# EAGLE design Macropad_BMS (EAGLE 9.6.2)
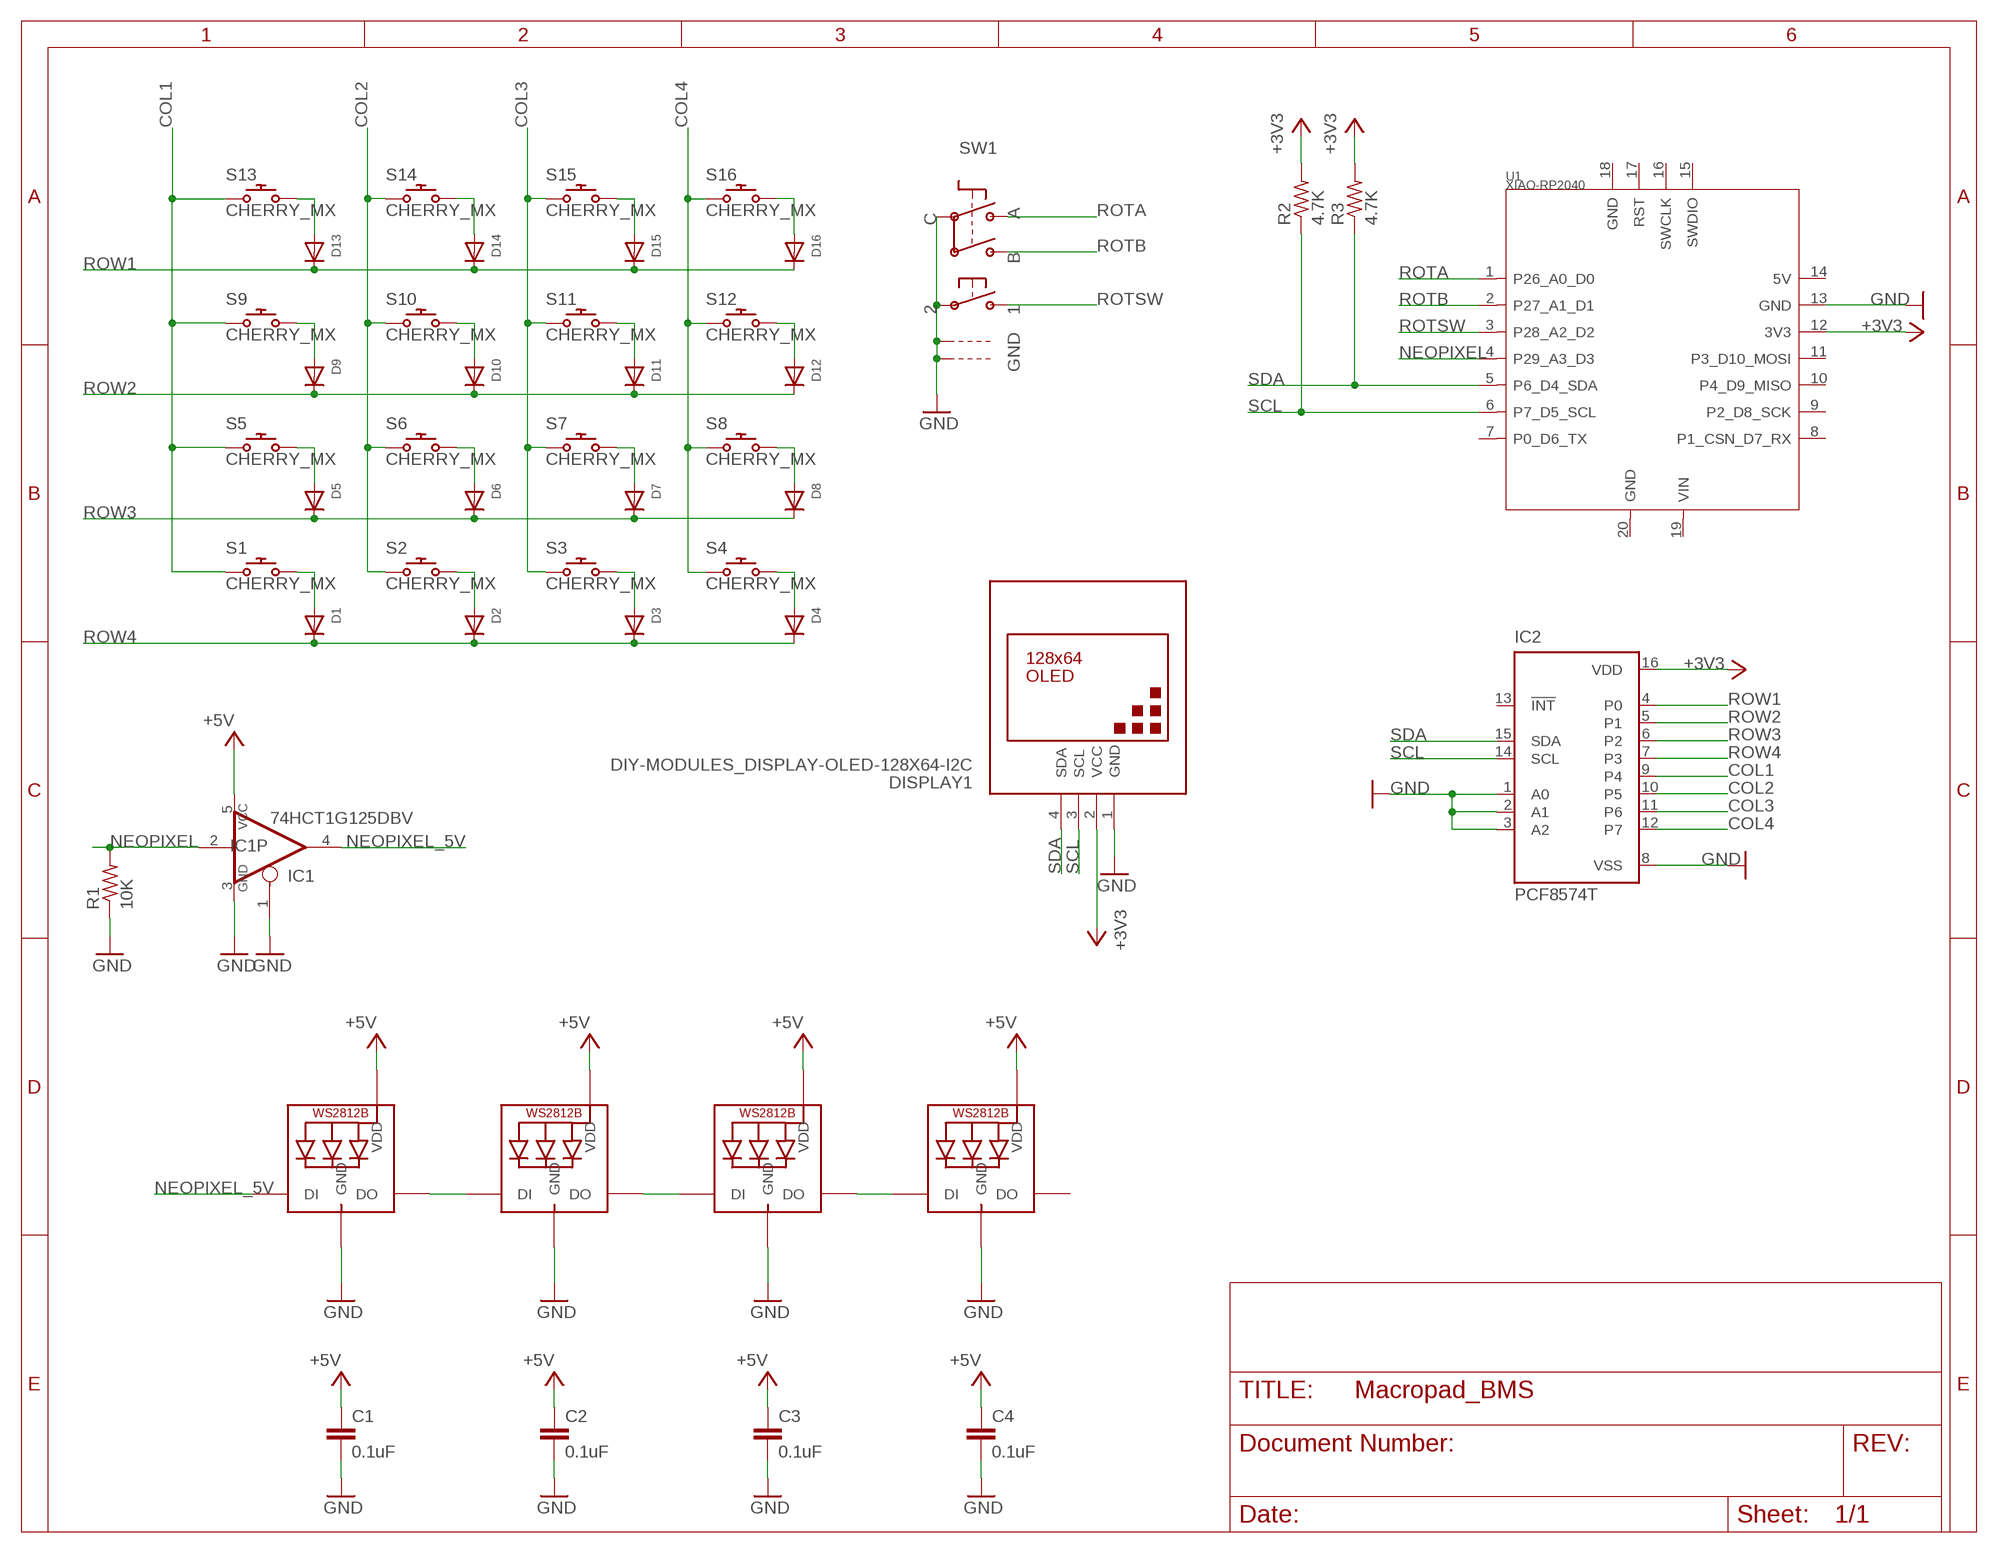
[diagram p0: schematic, sheet 1]

## Parts
C1  0.1uF  0.1UF-0603-25V-(+80/-20%)  [0603]
C2  0.1uF  0.1UF-0603-25V-(+80/-20%)  [0603]
C3  0.1uF  0.1UF-0603-25V-(+80/-20%)  [0603]
C4  0.1uF  0.1UF-0603-25V-(+80/-20%)  [0603]
D1  MICROBUILDER_DIODESOD-123  [MICROBUILDER_SOD-123]
D2  MICROBUILDER_DIODESOD-123  [MICROBUILDER_SOD-123]
D3  MICROBUILDER_DIODESOD-123  [MICROBUILDER_SOD-123]
D4  MICROBUILDER_DIODESOD-123  [MICROBUILDER_SOD-123]
D5  MICROBUILDER_DIODESOD-123  [MICROBUILDER_SOD-123]
D6  MICROBUILDER_DIODESOD-123  [MICROBUILDER_SOD-123]
D7  MICROBUILDER_DIODESOD-123  [MICROBUILDER_SOD-123]
D8  MICROBUILDER_DIODESOD-123  [MICROBUILDER_SOD-123]
D9  MICROBUILDER_DIODESOD-123  [MICROBUILDER_SOD-123]
D10  MICROBUILDER_DIODESOD-123  [MICROBUILDER_SOD-123]
D11  MICROBUILDER_DIODESOD-123  [MICROBUILDER_SOD-123]
D12  MICROBUILDER_DIODESOD-123  [MICROBUILDER_SOD-123]
D13  MICROBUILDER_DIODESOD-123  [MICROBUILDER_SOD-123]
D14  MICROBUILDER_DIODESOD-123  [MICROBUILDER_SOD-123]
D15  MICROBUILDER_DIODESOD-123  [MICROBUILDER_SOD-123]
D16  MICROBUILDER_DIODESOD-123  [MICROBUILDER_SOD-123]
DISPLAY1  DIY-MODULES_DISPLAY-OLED-128X64-I2C  [DIY-MODULES_DISPLAY-OLED-128X64-I2C]
IC1  74HCT1G125DBV  74AHC1G125DBV  [SOT23-5]
IC2  PCF8574T  [SO16W]
LED1  WS2812B5050  [WS2812B]
LED2  WS2812B5050  [WS2812B]
LED3  WS2812B5050  [WS2812B]
LED4  WS2812B5050  [WS2812B]
R1  10K  R-US_R0805  [R0805]
R2  4.7K  R-US_R0805  [R0805]
R3  4.7K  R-US_R0805  [R0805]
S1  CHERRY_MX  [CHERRY_MX]
S2  CHERRY_MX  [CHERRY_MX]
S3  CHERRY_MX  [CHERRY_MX]
S4  CHERRY_MX  [CHERRY_MX]
S5  CHERRY_MX  [CHERRY_MX]
S6  CHERRY_MX  [CHERRY_MX]
S7  CHERRY_MX  [CHERRY_MX]
S8  CHERRY_MX  [CHERRY_MX]
S9  CHERRY_MX  [CHERRY_MX]
S10  CHERRY_MX  [CHERRY_MX]
S11  CHERRY_MX  [CHERRY_MX]
S12  CHERRY_MX  [CHERRY_MX]
S13  CHERRY_MX  [CHERRY_MX]
S14  CHERRY_MX  [CHERRY_MX]
S15  CHERRY_MX  [CHERRY_MX]
S16  CHERRY_MX  [CHERRY_MX]
SW1  ADAFRUIT_ELECTROMECH_ENCODER_PLUS_SWITCH_BOURNS_PEC11  [ADAFRUIT_ELECTROMECH_PEC11+SWITCH]
U1  XIAO-RP2040  [XIAO-SAMD21/RP2040-MODULE14P-2.54-21X17.8MM]

## Nets
+3V3: DISPLAY1.2(VCC) IC2.16(VDD) R2.2 R3.2 U1.12(3V3)
+5V: C1.1 C2.1 C3.1 C4.1 IC1.5(VCC) LED1.1-VDD(VDD) LED2.1-VDD(VDD) LED3.1-VDD(VDD) LED4.1-VDD(VDD)
COL1: IC2.9(P4) S1.S1 S5.S1 S9.S1 S13.S1
COL2: IC2.10(P5) S2.S1 S6.S1 S10.S1 S14.S1
COL3: IC2.11(P6) S3.S1 S7.S1 S11.S1 S15.S1
COL4: IC2.12(P7) S4.S1 S8.S1 S12.S1 S16.S1
GND: C1.2 C2.2 C3.2 C4.2 DISPLAY1.1(GND) IC1.1(OE) IC1.3(GND) IC2.1(A0) IC2.2(A1) IC2.3(A2) IC2.8(VSS) LED1.3-GND(GND) LED2.3-GND(GND) LED3.3-GND(GND) LED4.3-GND(GND) R1.1 SW1.P$2 SW1.P$C SW1.P$GND1 SW1.P$GND2 U1.13(GND)
N$2: D13.A S13.S2
N$3: D14.A S14.S2
N$4: LED1.2-DOUT(DO) LED2.4-DIN(DI)
N$5: LED2.2-DOUT(DO) LED3.4-DIN(DI)
N$6: LED3.2-DOUT(DO) LED4.4-DIN(DI)
N$7: D15.A S15.S2
N$8: D16.A S16.S2
N$9: D9.A S9.S2
N$10: D10.A S10.S2
N$11: D11.A S11.S2
N$12: D12.A S12.S2
N$13: D5.A S5.S2
N$14: D6.A S6.S2
N$15: D7.A S7.S2
N$16: D8.A S8.S2
N$18: D1.A S1.S2
N$19: D2.A S2.S2
N$20: D3.A S3.S2
N$21: D4.A S4.S2
NEOPIXEL: IC1.2(I) R1.2 U1.4(P29_A3_D3)
NEOPIXEL_5V: IC1.4(O) LED1.4-DIN(DI)
ROTA: SW1.P$A U1.1(P26_A0_D0)
ROTB: SW1.P$B U1.2(P27_A1_D1)
ROTSW: SW1.P$1 U1.3(P28_A2_D2)
ROW1: D13.C D14.C D15.C D16.C IC2.4(P0)
ROW2: D9.C D10.C D11.C D12.C IC2.5(P1)
ROW3: D5.C D6.C D7.C D8.C IC2.6(P2)
ROW4: D1.C D2.C D3.C D4.C IC2.7(P3)
SCL: DISPLAY1.3(SCL) IC2.14(SCL) R2.1 U1.6(P7_D5_SCL)
SDA: DISPLAY1.4(SDA) IC2.15(SDA) R3.1 U1.5(P6_D4_SDA)
Unconnected: IC2.13(!INT) LED4.2-DOUT(DO) U1.7(P0_D6_TX) U1.8(P1_CSN_D7_RX) U1.9(P2_D8_SCK) U1.10(P4_D9_MISO) U1.11(P3_D10_MOSI) U1.14(5V) U1.15(SWDIO) U1.16(SWCLK) U1.17(RST) U1.18(GND) U1.19(VIN) U1.20(GND)

## Library data of the parts
C1-C4 = SparkFun-Capacitors:0.1UF: 0.1µF ceramic capacitors A capacitor is a passive two-terminal electrical component used to store electrical energy temporarily in an electric field.; PROD_ID: CAP-00810
D1-D16 = Adafruit MacroPad 2040:MICROBUILDER_DIODE: Diode SMA Model Volts Amps Type Vf Ir Digikey # Notes SSA34-E3 40V 3A Schottky 480mV @ 3A 200uA @ 40V SSA34-E3/61TGITR-ND CDBA120-G 20V 1A Schottky 500mV @ 1A 500uA @ 20V 641-1014-6-ND REEL MBRA210 10V 2A Schottky 350mV @ 2A 700uA @ 10V MBRA210LT3 SOD-123 Model Volts Amps Type Vf Ir Order # Notes BAT54T1G 30V 200mA Schottky 800mV @ 200mA 2uA @ 25V BAT54T1GOSTR-ND B0530W 30V 500mA Schottky 430mV @ 500mA 130uA @ 30V B0530W-FDICT-ND REEL MBR120 20V 1A Schottky 340mV @ 1A MBR120VLSFT1GOSCT-ND SOD-323 Model Volts Amps Type Vf Ir Order # Notes PMEG2005EJ 20V 500mA Schottky 355mV @ 500mA 568-4110-1-ND ZLLS410 10V 570mA Schottky 380mV @ 570mA ZLLS410CT-ND 1N4148WS 75V 150mA Silicon/Simple 1V 1N4148WSFSCT-ND REEL SOD-523 Model Volts Amps Type Vf Ir Order # Notes BAT54XV2 30V 200mA Schottky 0.8V @ 100mA BAT54XV2CT-ND TB751S 30V 30mA Schottky RB751S-40TE61CT-ND SOT23-R/W (R = Solder Paste/Reflow Ovens, W = Hand-Soldering) Model Volts Amps Type Vf Ir Order # Notes BAT54FILM 40V 300mA Schottky 497-7162-1-ND POWERDI-5 Model Volts Amps Type Vf Ir Order # Notes PDS560 60V 5A Schottky 670mV @ 5A 150uA @ 60V PDS560DICT-ND
DISPLAY1 = diy-modules:DIY-MODULES_DISPLAY-OLED-128X64-I2C: 128x64 Dot Matrix OLED Module based on SSD1306 chip Variant with I2C interface More details available here: http://www.instructables.com/id/Monochrome-096-i2c-OLED-display-with-arduino-SSD13/ SSD1306 datasheet: https://cdn-shop.adafruit.com/datasheets/SSD1306.pdf Click here to find device on ebay.com <http://www.ebay.com/sch/oled+display+128x64+iic> Note: There are two variants: I2C and SPI. Search for the proper version.
IC1 = 74xx-little-us:74*1G125: Single Bus Buffer Gate with 3-State Output
IC2 = micro-philips:PCF8574: I2C-Bus Remote 8-bit I/O expander http://www.semiconductors.philips.com/acrobat_download/datasheets/PCF8574_4.pdf; MPN: PCF8574T/3,512; OC_FARNELL: 1201255; OC_NEWARK: 70R6870
LED1-LED4 = adafruit:WS2812B
R1-R3 = adafruit:R-US_: RESISTOR, American symbol
S1-S16 = cherry:CHERRY_MX: Cherry keymodule MX; FARNELL: 2292961; MOUSER: 540-MX1A-11NW
SW1 = Adafruit MacroPad 2040:ADAFRUIT_ELECTROMECH_ENCODER_PLUS_SWITCH: Rotary Encoder with Built-In Switch PEC11 - 24 Step, PEC11-4215F-S24 - http://www.adafruit.com/products/377
U1 = Seeed Studio XIAO Series:XIAO-RP2040: Seeed Studio XIAO RP2040 v1.22 - Raspberry Pi RP2040 Microcontroller - 32-bit 133MHz Dual-Core ARM® Cortex® M0+processor Seeed SKU: 102010428 Seeed Studio XIAO RP2040 is a microcontroller using the Raspberry Pi RP2040 chip. The MCU runs at up to 133MHz. It is built with rich interfaces in a tiny thumb size and fully supports Arduino, MicroPython, and CircuitPython. The onboard interfaces are enough for developing multiple applications. Buy now <https://www.seeedstudio.com/XIAO-RP2040-v1-0-p-5026.html> Wiki <https://wiki.seeedstudio.com/XIAO-RP2040/>

## Net classes
0 default: width 0.178 mm
2 5V: width 0.406 mm, drill 0.483 mm

## Board
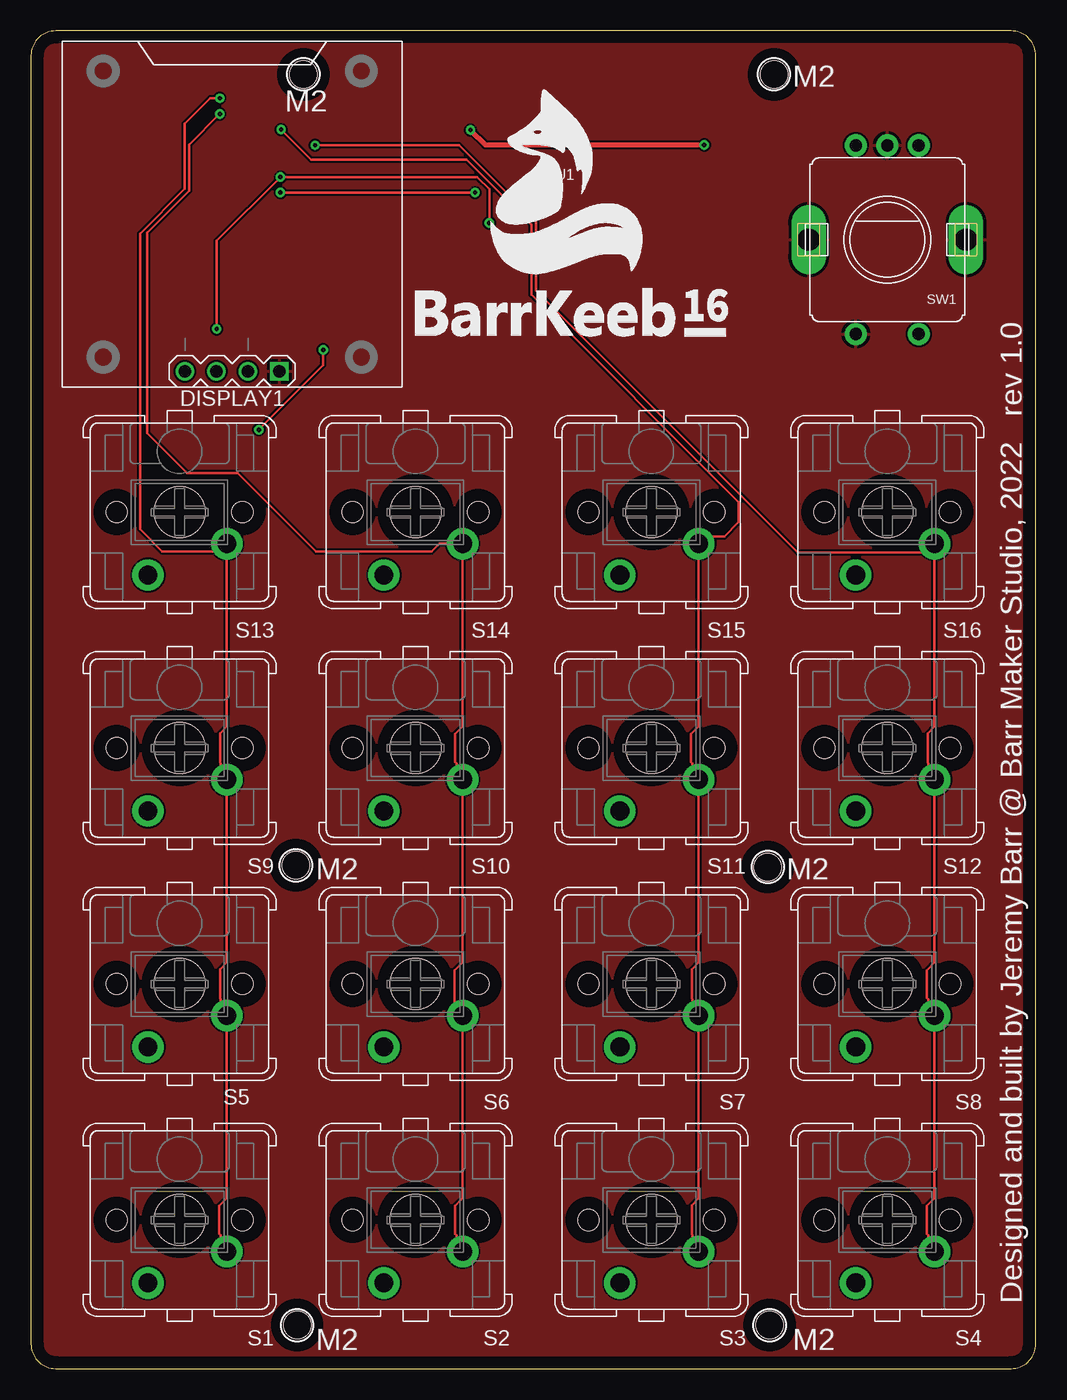
[diagram p1: board, top side]
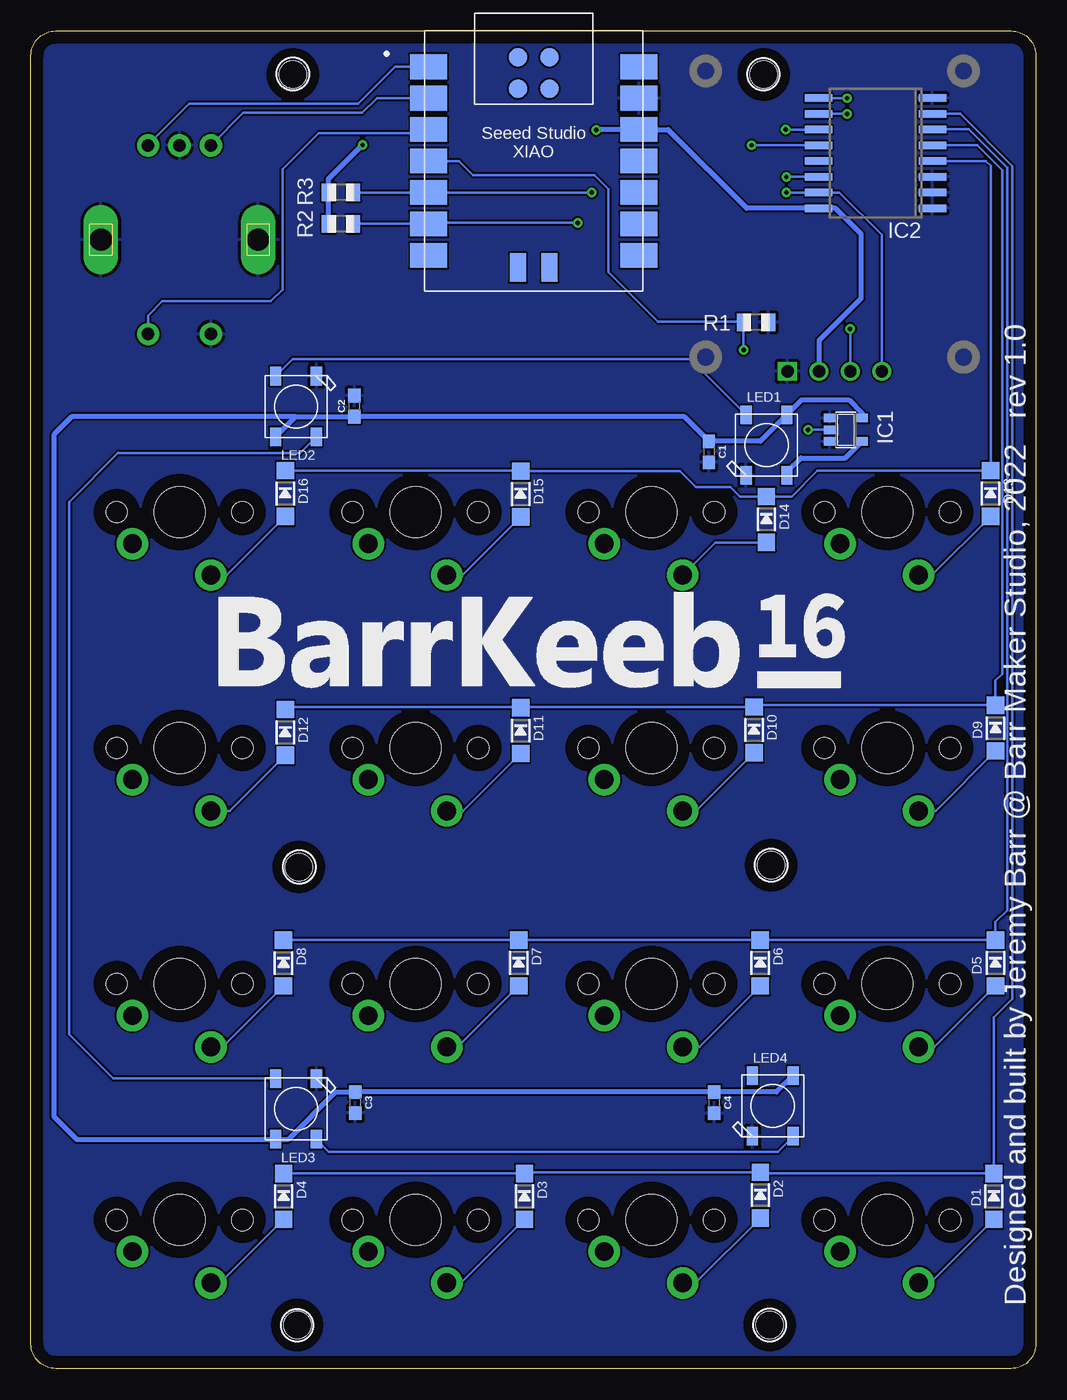
[diagram p2: board, bottom side, seen from below]

Size 81.15 x 108 mm. Coordinates in mm from the lower left corner, seen from the top.
Outline: 0,106 0,2 arc90 2,0 79.15,0 arc90 81.15,2 81.15,106 arc90 79.15,108 2,108 arc90 0,106
Copper layers (1*16): Top 0.035mm / dielectric 1.5mm / Bottom 0.035mm
Design rules "default": minimum track width 6mil, minimum drill 0.35mm, track to track 6mil, track to pad 6mil, pad to pad 6mil, via to via 6mil, smd to smd 6mil, copper to edge 40mil, drill to drill 6mil, minimum pad ring 10mil, minimum via ring 8mil, stop-mask expansion 4mil, vias tented up to drill 0mil, thermal gap 10mil
Holes 2.2 mm at 21.5,3.5 59.66,3.5 59.5,40.5 21.38,40.62 60,104.5 22,104.5

### Footprints (pad centres in the part's own frame; a part is rotated, then mirrored left to right if it is on the bottom)
0603 = smd 1.1 x 1: 1 -0.85,0; 2 0.85,0
MICROBUILDER_SOD-123 = smd 1.4 x 1.4: A 1.85,0; C -1.85,0
DIY-MODULES_DISPLAY-OLED-128X64-I2C = drill 1 square: 1 -3.81,11.43 | drill 1: 2 -1.27,11.43; 3 1.27,11.43; 4 3.81,11.43
SOT23-5 = smd 0.69 x 0.99: 1 -0.95,-1.29; 2 0,-1.29; 3 0.95,-1.29; 4 0.95,1.3; 5 -0.95,1.3
SO16W = smd 0.6 x 2.2: 1 -4.445,-4.6; 2 -3.175,-4.6; 3 -1.905,-4.6; 4 -0.635,-4.6; 5 0.635,-4.6; 6 1.905,-4.6; 7 3.175,-4.6; 8 4.445,-4.6; 9 4.445,4.6; 10 3.175,4.6; 11 1.905,4.6; 12 0.635,4.6; 13 -0.635,4.6; 14 -1.905,4.6; 15 -3.175,4.6; 16 -4.445,4.6
WS2812B = smd 1.5 x 0.9: 1-VDD 2.45,-1.65; 2-DOUT 2.45,1.65; 3-GND -2.45,1.65; 4-DIN -2.45,-1.65
R0805 = smd 1.1 x 1.4: 1 -1,0; 2 1,0
CHERRY_MX = drill 1.5 pad 2.54: S1 -3.81,2.54; S2 2.54,5.08 | hole 1.7: -5.08,0; 5.08,0 | hole 4.1: 0,0
ADAFRUIT_ELECTROMECH_PEC11+SWITCH = drill 1 pad 1.8: P$1 -2.54,7.62; P$2 2.54,7.62; P$A -2.54,-7.62; P$B 2.54,-7.62; P$C 0,-7.62 | drill 1.8 pad 2.8 long: P$GND1 -6.35,0; P$GND2 6.35,0
XIAO-SAMD21/RP2040-MODULE14P-2.54-21X17.8MM = smd 3 x 2: 1 -8.5,7.62; 2 -8.5,5.08; 3 -8.5,2.54; 4 -8.5,0; 5 -8.5,-2.54; 6 -8.5,-5.08; 7 -8.5,-7.62; 8 8.5,-7.62; 9 8.5,-5.08; 10 8.5,-2.54; 11 8.5,0; 12 8.5,2.54; 13 8.5,5.08; 14 8.5,7.62 | smd 1.5 x 1.5: 15 -1.27,8.39; 16 1.27,8.39; 17 -1.27,5.85; 18 1.27,5.85 | smd 1.3 x 2.3: 19 -1.27,-8.6; 20 1.27,-8.6

### Placement (x,y rotation side)
C1  26.41,74.03 270 bottom
C2  55.03,77.71 90 bottom
C3  54.97,21.48 270 bottom
C4  25.97,21.47 270 bottom
D1  3.4,13.9 270 bottom
D2  22.25,13.99 270 bottom
D3  41.3,13.9 270 bottom
D4  60.75,13.9 270 bottom
D5  3.26,32.75 270 bottom
D6  22.26,32.75 270 bottom
D7  41.76,32.75 270 bottom
D8  60.76,32.74 270 bottom
D9  3.26,51.71 270 bottom
D10  22.76,51.56 270 bottom
D11  41.61,51.51 270 bottom
D12  60.61,51.36 270 bottom
D13  3.66,70.65 270 bottom
D14  21.76,68.56 270 bottom
D15  41.61,70.61 270 bottom
D16  60.61,70.65 270 bottom
DISPLAY1  16.25,91.95 180 top
IC1  15.35,75.8 270 bottom
IC2  12.95,98.13 90 bottom
LED1  21.75,74.57 90 bottom
LED2  59.75,77.68 270 bottom
LED3  59.75,20.96 270 bottom
LED4  21.25,21.21 90 bottom
R1  22.6,84.48 180 bottom
R2  56.12,92.43 180 bottom
R3  56.12,94.97 180 bottom
S1  12,12 180 top
S2  31.05,12 180 top
S3  50.1,12 180 top
S4  69.15,12 180 top
S5  12,31.05 180 top
S6  31.05,31.05 180 top
S7  50.1,31.05 180 top
S8  69.15,31.05 180 top
S9  12,50.1 180 top
S10  31.05,50.1 180 top
S11  50.1,50.1 180 top
S12  69.15,50.1 180 top
S13  12,69.15 180 top
S14  31.05,69.15 180 top
S15  50.1,69.15 180 top
S16  69.15,69.15 180 top
SW1  69.15,91.15 180 top
U1  40.55,97.5 0 bottom
U$1  [BARRKEEP16-LOGO]  29.77,81.5 0 top
U$2  [BARRKEEB-16]  68.46,50.32 0 bottom

### Tracks (layer width: path | path; a pad name or v marks a point on that pad's centre or on a via)
+3V3  (via drill 0.35)
  Top 0.406: v54.38,98.8 36.7,98.8 v35.5,100
  Bottom 0.178: 35.46,100.04 v35.5,100
  Bottom 0.406: R2.2 R3.2 57.12,96.06 v54.38,98.8 | 35.46,100.04 U1.12 29.7,100.04 23.34,93.69 IC2.16 16.18,93.69 14.1,91.6 14.1,86.42 17.5,83.03 17.5,80.54 DISPLAY1.2
+5V
  Bottom 0.406: IC1.5 14.04,77.15 15.12,78.22 18.9,78.22 LED1.1-VDD 22.25,74.88 C1.1 28.39,76.86 C2.1 59.77,76.86 | LED2.1-VDD 59.77,76.86 | 59.77,76.86 77.84,76.86 79.3,75.4 79.3,20.35 77.45,18.5 LED3.1-VDD 60.35,18.51 56.53,22.33 C3.1 C4.1 20.94,22.32 LED4.1-VDD
COL1  (via drill 0.35)
  Top 0.203: S1.S1 15.32,9.95 15.32,10.76 15.21,10.87 15.21,13.13 15.81,13.73 S5.S1 15.32,29 15.32,29.81 15.26,29.87 15.26,32.23 15.81,32.78 S9.S1 15.32,48.05 15.32,48.86 15.26,48.92 15.26,51.28 15.81,51.83 S13.S1 15.16,65.96 10.61,65.96 8.8,67.77 8.8,91.65 12.4,95.25 12.4,100.5 14.47,102.58 v15.25,102.58
  Bottom 0.203: IC2.9 v15.25,102.58
COL2  (via drill 0.35)
  Top 0.203: S2.S1 34.37,9.95 34.37,10.76 34.26,10.87 34.26,13.13 34.86,13.73 S6.S1 34.22,29.15 34.22,32.14 34.86,32.78 S10.S1 34.37,48.05 34.37,48.86 34.26,48.97 34.26,51.23 34.86,51.83 S14.S1 32.99,66.61 32.36,65.98 23.03,65.98 16.7,72.32 12.6,72.32 9.38,75.54 9.38,91.72 12.76,95.1 12.76,98.81 v15.25,101.3
  Bottom 0.203: v15.25,101.3 v15.26,101.31 IC2.10
COL3  (via drill 0.35)
  Top 0.203: S3.S1 53.42,9.95 53.42,10.76 53.36,10.82 53.36,13.18 53.91,13.73 S7.S1 53.42,29 53.42,29.81 53.36,29.87 53.36,32.23 53.91,32.78 S11.S1 53.42,48.05 53.42,48.86 53.31,48.97 53.31,51.23 53.91,51.83 S15.S1 54.48,67.18 55.99,67.18 57.15,68.33 57.15,69.97 40.41,86.7 40.41,92.37 35.18,97.6 22.64,97.6 v20.2,100.03
  Bottom 0.203: IC2.11 v20.2,100.03
COL4  (via drill 0.35)
  Top 0.203: S4.S1 72.47,9.95 72.47,10.76 72.36,10.87 72.36,13.13 72.96,13.73 S8.S1 72.47,29 72.47,29.81 72.33,29.95 72.33,32.15 72.96,32.78 S12.S1 72.47,48.05 72.47,48.86 72.41,48.92 72.41,51.28 72.96,51.83 S16.S1 72.23,65.89 61.94,65.89 40.77,87.05 40.77,92.56 34.55,98.78 v22.95,98.78
  Bottom 0.203: IC2.12 17.58,98.8 22.93,98.8 v22.95,98.78
GND
  pour Top: 0,108 81.15,108 81.15,0 0,0
  pour Bottom: 0,108 81.15,108 81.15,0 0,0
N$2
  Bottom 0.203: S13.S2 8.39,64.07 D13.A
N$3
  Bottom 0.203: S14.S2 25.87,66.71 D14.A
N$4
  Bottom 0.203: LED1.2-DOUT 27.88,81.5 60.03,81.5 LED2.4-DIN
N$5
  Bottom 0.203: LED2.2-DOUT 59.43,73.9 74.05,73.9 74.1,73.95 78.08,69.97 78.08,26.98 74.51,23.41 LED3.4-DIN
N$6
  Bottom 0.203: LED3.2-DOUT 57.1,17.51 20.85,17.51 LED4.4-DIN
N$7
  Bottom 0.203: S15.S2 46.3,64.07 D15.A
N$8
  Bottom 0.203: S16.S2 65.34,64.07 D16.A
N$9
  Bottom 0.203: S9.S2 8.1,45.02 D9.A
N$10
  Bottom 0.203: S10.S2 27.45,45.02 D10.A
N$11
  Bottom 0.203: S11.S2 46.25,45.02 D11.A
N$12
  Bottom 0.203: S12.S2 65.1,45.02 D12.A
N$13
  Bottom 0.203: S5.S2 8.19,25.97 D5.A
N$14
  Bottom 0.203: S6.S2 27.19,25.97 D6.A
N$15
  Bottom 0.203: S7.S2 46.69,25.97 D7.A
N$16
  Bottom 0.203: S8.S2 65.69,25.97 D8.A
N$18
  Bottom 0.203: D1.A 8.53,6.92 S1.S2
N$19
  Bottom 0.203: S2.S2 27.48,6.92 D2.A
N$20
  Bottom 0.203: S3.S2 46.43,6.92 D3.A
N$21
  Bottom 0.203: S4.S2 65.89,6.92 D4.A
NEOPIXEL  (via drill 0.35)
  Top 0.203: v18.4,75.8 23.6,81 v23.6,82.25
  Bottom 0.203: U1.4 46.6,97.5 45.46,96.36 35.64,96.36 34.5,95.22 34.5,88.53 30.5,84.53 23.65,84.53 R1.2 v23.6,82.25 | IC1.2 v18.4,75.8
NEOPIXEL_5V
  Bottom 0.406: LED1.4-DIN 20.1,72.42 18.99,73.53 15.37,73.53 IC1.4
ROTA
  Bottom 0.203: U1.1 51.75,105.12 54.75,102.12 68.38,102.12 71.69,98.81 SW1.P$A
ROTB
  Bottom 0.203: U1.2 53.2,102.58 54.4,101.38 64,101.38 SW1.P$B
ROTSW
  Bottom 0.203: U1.3 49.35,99.74 57.94,99.74 60.83,96.85 60.83,87.13 61.79,86.17 70.55,86.17 71.69,85.03 SW1.P$1
ROW1
  Bottom 0.203: D16.C 41.65,72.5 D15.C 28.76,72.47 27.46,71.16 24.67,71.16 23.91,70.41 D14.C 19.72,70.41 17.63,72.5 D13.C 3.66,97.11 4.05,97.5 IC2.4
ROW2
  Bottom 0.203: D12.C 60.4,53.42 41.67,53.42 D11.C 41.55,53.42 D10.C 22.61,53.56 D9.C 3.26,55.54 2.71,56.09 2.71,96.76 4.71,98.77 IC2.5
ROW3
  Bottom 0.203: D8.C D7.C D6.C D5.C 3.26,36.05 2.31,37.01 2.31,96.96 5.4,100.05 8.34,100.05 IC2.6
ROW4
  Bottom 0.203: D4.C D3.C 41.2,15.85 D2.C 22.16,15.75 D1.C 3.4,28.35 1.9,29.85 1.9,97.1 6.11,101.31 IC2.7
SCL  (via drill 0.35)
  Top 0.203: v37.01,92.5 37.01,95.22 36.03,96.2 v20.15,96.2 15,91.05 v15,83.95
  Bottom 0.178: U1.6
  Bottom 0.203: R2.1 U1.6 | IC2.14 20.12,96.22 v20.15,96.2 | U1.6 48.95,92.52 37.03,92.52 v37.01,92.5 | DISPLAY1.3 14.98,83.93 v15,83.95
SDA  (via drill 0.35)
  Top 0.203: v20.15,94.95 v35.86,94.95
  Bottom 0.178: R3.1
  Bottom 0.203: R3.1 U1.5 v35.86,94.95 | v20.15,94.95 v20.14,94.95 IC2.15 15.86,94.95 12.45,91.55 DISPLAY1.4

### Text on the board
tPlace: M2 | M2 | M2 | M2 | Designed and built by Jeremy Barr @ Barr Maker Studio, 2022 rev 1.0 | M2 | M2
bPlace: Designed and built by Jeremy Barr @ Barr Maker Studio, 2022 rev 1.0